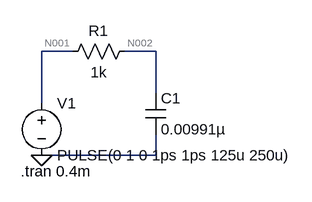
[diagram p0: schematic AC.asc]
AC.asc, the LTspice schematic file:
Version 4
SHEET 1 880 680
WIRE 144 64 96 64
WIRE 272 64 224 64
WIRE 272 128 272 64
WIRE 96 144 96 64
WIRE 272 224 272 192
WIRE 272 224 96 224
FLAG 96 224 0
SYMBOL voltage 96 128 R0
WINDOW 123 0 0 Left 2
WINDOW 39 0 0 Left 2
SYMATTR InstName V1
SYMATTR Value PULSE(0 1 0 1ps 1ps 125u 250u)
SYMBOL cap 256 128 R0
SYMATTR InstName C1
SYMATTR Value 0.00991µ
SYMBOL res 240 48 R90
WINDOW 0 0 56 VBottom 2
WINDOW 3 32 56 VTop 2
SYMATTR InstName R1
SYMATTR Value 1k
TEXT 64 248 Left 2 !.tran 0.4m

The netlist it stands for:
* AC.asc
V1 N001 0 PULSE(0 1 0 1ps 1ps 125u 250u)
C1 N002 0 0.00991µ
R1 N002 N001 1k
.tran 0.4m
.backanno
.end

* Results of the author's LTspice run, read from the files saved beside the schematic
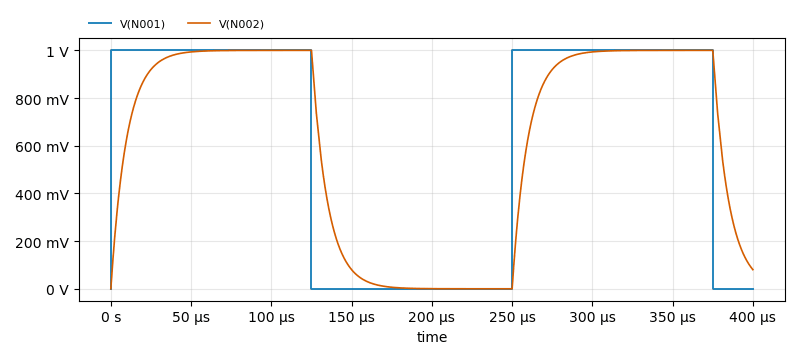
[diagram p1: Transient Analysis of AC.asc, plotted from the saved traces]
* Transient Analysis, 1 run:
*   V(N001): min 0 V, max 1 V, average 625 mV, rms 790.6 mV, last 0 V
*   V(N002): min 0 V, max 1 V, average 623.2 mV, rms 758.9 mV, last 80.22 mV